# Altium project blm_ctrl.PrjPCB
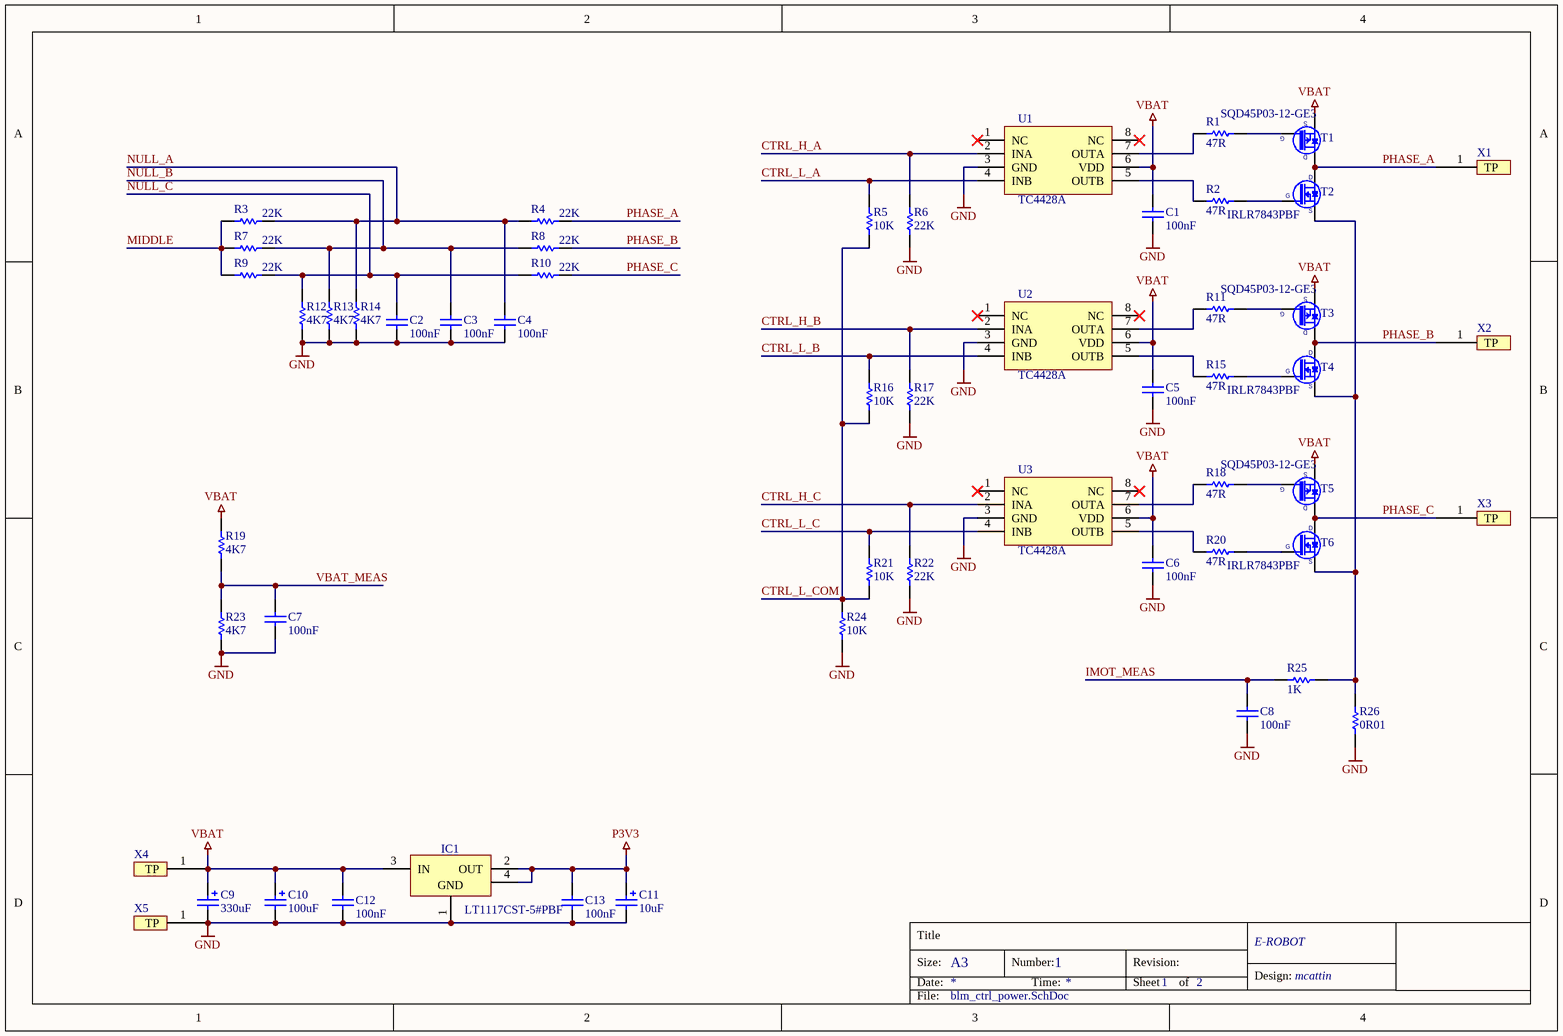
[diagram p0: blm_ctrl_power.SchDoc]
2 sheets, 101 parts. Net scope: global (net labels, ports and power ports of the same name join across sheets).
Board file: blm_ctrl.PcbDoc
Sheets:
  blm_ctrl_power.SchDoc
  blm_ctrl_cortex.SchDoc

## Sheet blm_ctrl_power.SchDoc
size A4; DrawnBy: mcattin; Organization: E-ROBOT; DocumentNumber: 1; SheetNumber: 1; SheetTotal: 2

### Parts
C1  value 100nF  [0603]  (hidden comment: Cap)
C2  value 100nF  [0603]  (hidden comment: Cap)
C3  value 100nF  [0603]  (hidden comment: Cap)
C4  value 100nF  [0603]  (hidden comment: Cap)
C5  value 100nF  [0603]  (hidden comment: Cap)
C6  value 100nF  [0603]  (hidden comment: Cap)
C7  value 100nF  [0603]  (hidden comment: Cap)
C8  value 100nF  [0603]  (hidden comment: Cap)
C9  value 330uF  [C00101]  (hidden comment: Cap Pol2)
C10  value 100uF  [C00101]  (hidden comment: Cap Pol2)
C11  value 10uF  [1206]  (hidden comment: Cap Pol2)
C12  value 100nF  [0603]  (hidden comment: Cap)
C13  value 100nF  [0603]  (hidden comment: Cap)
IC1  LT1117CST-5#PBF  [SOT230P700X180-4N]
R1  value 47R  [0603]  (hidden comment: Res1)
R2  value 47R  [0603]  (hidden comment: Res1)
R3  value 22K  [0603]  (hidden comment: Res1)
R4  value 22K  [0603]  (hidden comment: Res1)
R5  value 10K  [0603]  (hidden comment: Res1)
R6  value 22K  [0603]  (hidden comment: Res1)
R7  value 22K  [0603]  (hidden comment: Res1)
R8  value 22K  [0603]  (hidden comment: Res1)
R9  value 22K  [0603]  (hidden comment: Res1)
R10  value 22K  [0603]  (hidden comment: Res1)
R11  value 47R  [0603]  (hidden comment: Res1)
R12  value 4K7  [0603]  (hidden comment: Res1)
R13  value 4K7  [0603]  (hidden comment: Res1)
R14  value 4K7  [0603]  (hidden comment: Res1)
R15  value 47R  [0603]  (hidden comment: Res1)
R16  value 10K  [0603]  (hidden comment: Res1)
R17  value 22K  [0603]  (hidden comment: Res1)
R18  value 47R  [0603]  (hidden comment: Res1)
R19  value 4K7  [0603]  (hidden comment: Res1)
R20  value 47R  [0603]  (hidden comment: Res1)
R21  value 10K  [0603]  (hidden comment: Res1)
R22  value 22K  [0603]  (hidden comment: Res1)
R23  value 4K7  [0603]  (hidden comment: Res1)
R24  value 10K  [0603]  (hidden comment: Res1)
R25  value 1K  [0603]  (hidden comment: Res1)
R26  value 0R01  [2512]  (hidden comment: Res1)
T1  SQD45P03-12-GE3  [TO-252AA]
T2  IRLR7843PBF  [TO-252AA]
T3  SQD45P03-12-GE3  [TO-252AA]
T4  IRLR7843PBF  [TO-252AA]
T5  SQD45P03-12-GE3  [TO-252AA]
T6  IRLR7843PBF  [TO-252AA]
U1  TC4428A  [SOIC127P600-8BN]
U2  TC4428A  [SOIC127P600-8BN]
U3  TC4428A  [SOIC127P600-8BN]
X1  (no value)  [PAD_SMD_2x7MM]
X2  (no value)  [PAD_SMD_2x7MM]
X3  (no value)  [PAD_SMD_2x7MM]
X4  (no value)  [PAD_SMD_2x7MM]
X5  (no value)  [PAD_SMD_2x7MM]

### Nets
GND: C1.2 C2.2 C3.2 C4.2 C5.2 C6.2 C7.2 C8.2 C9.2 C10.2 C11.2 C12.2 C13.2 IC1.1(GND) R6.2 R12.2 R13.2 R14.2 R17.2 R22.2 R23.2 R24.2 R26.2 U1.3(GND) U2.3(GND) U3.3(GND) X5.1(TP)
P3V3: C11.1 C13.1 IC1.2(OUT) IC1.4(OUT)
VBAT: C1.1 C5.1 C6.1 C9.1 C10.1 C12.1 IC1.3(IN) R19.1 T1.3(S) T3.3(S) T5.3(S) U1.6(VDD) U2.6(VDD) U3.6(VDD) X4.1(TP)
CTRL_H_A: R6.1 U1.2(INA)
CTRL_H_B: R17.1 U2.2(INA)
CTRL_H_C: R22.1 U3.2(INA)
CTRL_L_A: R5.1 U1.4(INB)
CTRL_L_B: R16.1 U2.4(INB)
CTRL_L_C: R21.1 U3.4(INB)
CTRL_L_COM: R5.2 R16.2 R21.2 R24.1
IMOT_MEAS: C8.1 R25.2
MIDDLE: R3.1 R7.1 R9.1
NULL_A: C4.1 R3.2 R4.1 R14.1
NULL_B: C3.1 R7.2 R8.1 R13.1
NULL_C: C2.1 R9.2 R10.1 R12.1
PHASE_A: R4.2 T1.4(D) T2.4(D) X1.1(TP)
PHASE_B: R8.2 T3.4(D) T4.4(D) X2.1(TP)
PHASE_C: R10.2 T5.4(D) T6.4(D) X3.1(TP)
VBAT_MEAS: C7.1 R19.2 R23.1
NetR1_1: R1.1 T1.1(G)
NetR1_2: R1.2 U1.7(OUTA)
NetR2_1: R2.1 T2.1(G)
NetR2_2: R2.2 U1.5(OUTB)
NetR11_1: R11.1 T3.1(G)
NetR11_2: R11.2 U2.7(OUTA)
NetR15_1: R15.1 T4.1(G)
NetR15_2: R15.2 U2.5(OUTB)
NetR18_1: R18.1 T5.1(G)
NetR18_2: R18.2 U3.7(OUTA)
NetR20_1: R20.1 T6.1(G)
NetR20_2: R20.2 U3.5(OUTB)
NetR25_1: R25.1 R26.1 T2.3(S) T4.3(S) T6.3(S)

Not connected (* = marked no-connect by the designer): U1 1(NC)* 8(NC)*; U2 1(NC)* 8(NC)*; U3 1(NC)* 8(NC)*

### Notes on the sheet
- Title
- Size:
- Date:
- A3
- Number:
- Time:
- Revision:
- Sheet
- of
- Design:
- File:

### Library data of the parts
C1-C8 C12 C13 = Cap: Capacitor
  C2-C8 C12 C13: Case: 0603
C9-C11 = Cap Pol2: Polarized Capacitor (Axial)
  C9: Case: 0603
  C11: Case: 1206
IC1 = LT1117IST-5#PBF: 3-Terminal Regulator 1=GND 2=OUT 3=IN 4=OUT; Part Description: 5V, 800mA Low-Dropout Positive Regulator; Manufacturer: LINEAR TECHNOLOGY; Fournisseur: Farnell; Ref_fournisseur: 1663357; Part Number: LT1117CST-5#PBF; Device: LT1117CST-5#PBF; Case: SOT223; Price: 5.50 CHF
R1-R26 = Res1: Resistor; Case: 0603
T1 T3 T5 = BSH203: P-CHANNEL MOSFET WITH DIODE; Part Description: P-Channel 30 V (D-S) 175 °C MOSFET; Manufacturer: Vishay; Fournisseur: Farnell; Ref_fournisseur: 1869912; Part Number: SQD45P03-12-GE3; Device: SQD45P03-12-GE3; Footprint: SOT95P230X110-3N; Case: SOT252; Price: 3.60 CHF
T2 T4 T6 = BSS123: N-CHANNEL MOSFET WITH DIODE; Part Description: N MOSFET; Manufacturer: INTERNATIONAL RECTIFIER; Fournisseur: Farnell; Ref_fournisseur: 1013422; Part Number: IRLR7843PBF; Device: IRLR7843PBF; Footprint: SOT-252; Case: SOT252; Price: 2.10 CHF
U1-U3 = TC4428A: Manufacturer: MICROCHIP; Part Description: 1.5A Dual High-Speed Power MOSFET Drivers; Device: TC4428ACOA; Fournisseur: Farnell; Ref_fournisseur: 1332312; Case: SOIC8; Part Number: TC4428ACOA; Price: 1.35 CHF
X1-X5 = TEST_POINT

## Sheet blm_ctrl_cortex.SchDoc
size A4; DrawnBy: mcattin; Organization: E-ROBOT; DocumentNumber: 2; SheetNumber: 2; SheetTotal: 2
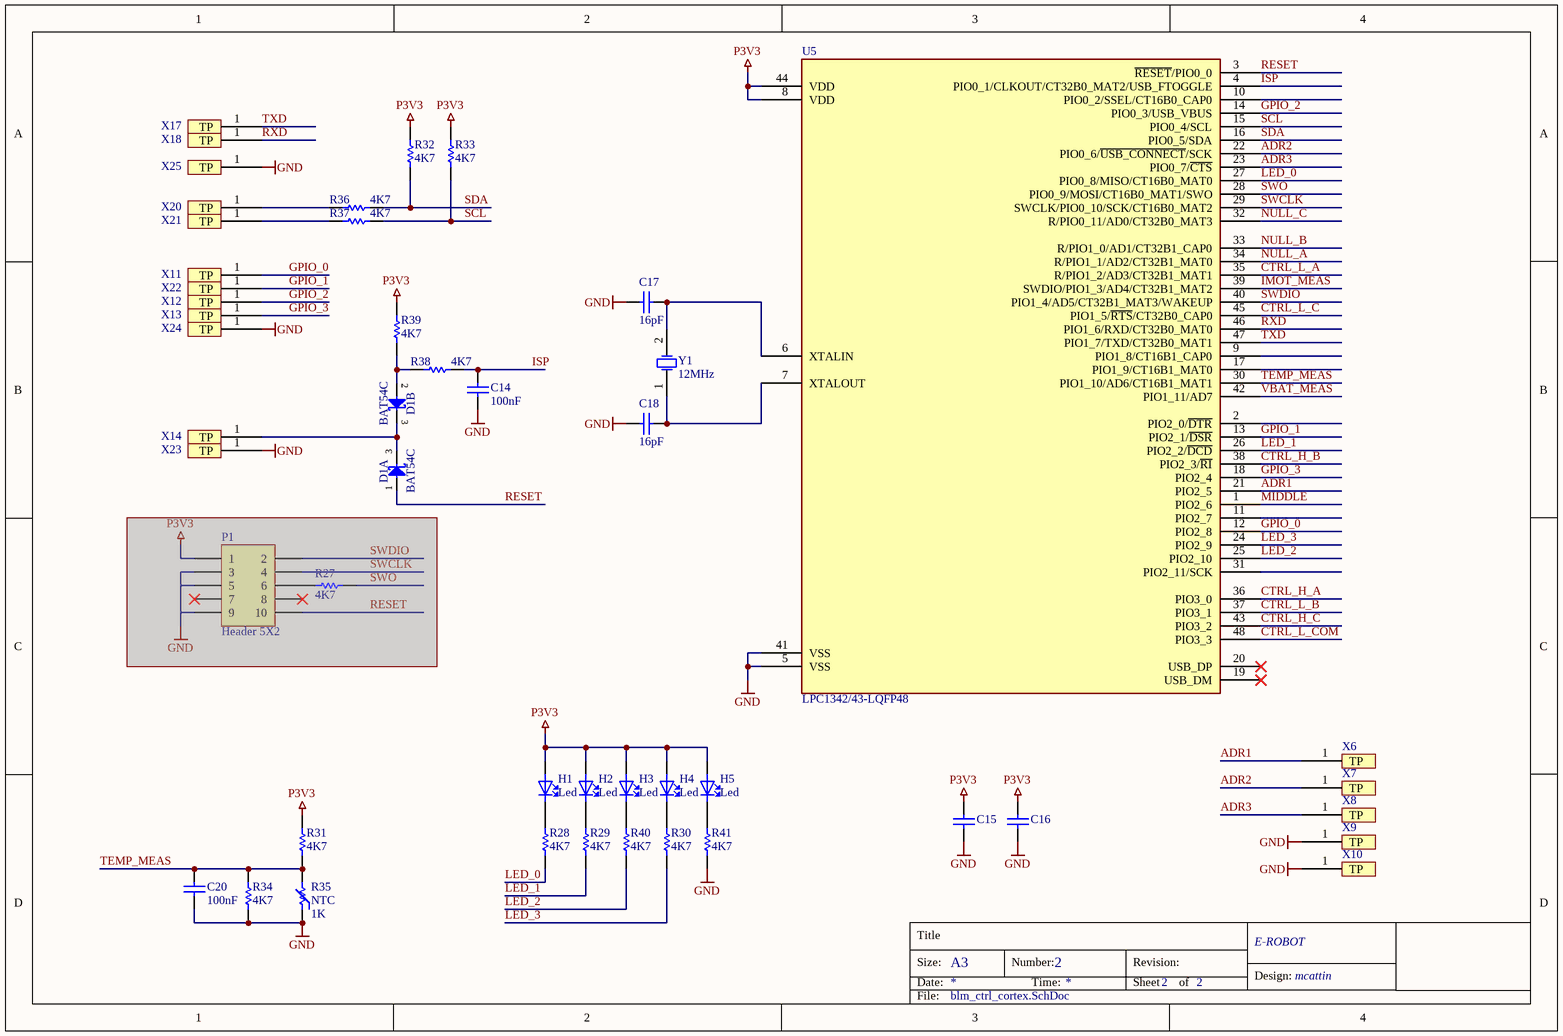
[diagram p1: blm_ctrl_cortex.SchDoc]

### Parts
C14  value 100nF  [0603]  (hidden comment: Cap)
C15  Cap  [0603]  (value not drawn)
C16  Cap  [0603]  (value not drawn)
C17  value 16pF  [0603]  (hidden comment: Cap)
C18  value 16pF  [0603]  (hidden comment: Cap)
C20  value 100nF  [0603]  (hidden comment: Cap)
D1  BAT54C  [SOT95P240X130-3N]  (parts A,B of 2)
H1  Led  [0603_LED]
H2  Led  [0603_LED]
H3  Led  [0603_LED]
H4  Led  [0603_LED]
H5  Led  [0603_LED]
P1  Header 5X2  [HDR2X5]  (masked out: inside a compile mask, not in the netlist)
R27  value 4K7  [0603]  (hidden comment: Res1)  (masked out: inside a compile mask, not in the netlist)
R28  value 4K7  [0603]  (hidden comment: Res1)
R29  value 4K7  [0603]  (hidden comment: Res1)
R30  value 4K7  [0603]  (hidden comment: Res1)
R31  value 4K7  [0603]  (hidden comment: Res1)
R32  value 4K7  [0603]  (hidden comment: Res1)
R33  value 4K7  [0603]  (hidden comment: Res1)
R34  value 4K7  [0603]  (hidden comment: Res1)
R35  NTC  value 1K  [0603]
R36  value 4K7  [0603]  (hidden comment: Res1)
R37  value 4K7  [0603]  (hidden comment: Res1)
R38  value 4K7  [0603]  (hidden comment: Res1)
R39  value 4K7  [0603]  (hidden comment: Res1)
R40  value 4K7  [0603]  (hidden comment: Res1)
R41  value 4K7  [0603]  (hidden comment: Res1)
U5  LPC1342/43-LQFP48  [TSQFP50P900X900-48N]
X6  (no value)  [PAD_SMD_0.5x1MM]
X7  (no value)  [PAD_SMD_0.5x1MM]
X8  (no value)  [PAD_SMD_0.5x1MM]
X9  (no value)  [PAD_SMD_0.5x1MM]
X10  (no value)  [PAD_SMD_0.5x1MM]
X11  (no value)  [PAD_SMD_1x2MM]
X12  (no value)  [PAD_SMD_1x2MM]
X13  (no value)  [PAD_SMD_1x2MM]
X14  (no value)  [PAD_SMD_1x2MM]
X17  (no value)  [PAD_SMD_1x2MM]
X18  (no value)  [PAD_SMD_1x2MM]
X20  (no value)  [PAD_SMD_1x2MM]
X21  (no value)  [PAD_SMD_1x2MM]
X22  (no value)  [PAD_SMD_1x2MM]
X23  (no value)  [PAD_SMD_1x2MM]
X24  (no value)  [PAD_SMD_1x2MM]
X25  (no value)  [PAD_SMD_1x2MM]
Y1  12MHz  [QUARTZ_SMD_CX5032]

### Nets
GND: C14.2 C15.2 C16.2 C17.1 C18.1 C20.2 R34.2 R35.2 R41.2 U5.5(VSS) U5.41(VSS) X9.1(TP) X10.1(TP) X23.1(TP) X24.1(TP) X25.1(TP)
P3V3: C15.1 C16.1 H1.1(ANODE) H2.1(ANODE) H3.1(ANODE) H4.1(ANODE) H5.1(ANODE) R31.1 R32.1 R33.1 R39.2 U5.8(VDD) U5.44(VDD)
ADR1: U5.21(PIO2_5) X6.1(TP)
ADR2: U5.22(PIO0_6/~{USB_CONNECT}/SCK) X7.1(TP)
ADR3: U5.23(PIO0_7/~{CTS}) X8.1(TP)
CTRL_H_A: U5.36(PIO3_0)
CTRL_H_B: U5.38(PIO2_3/~{RI})
CTRL_H_C: U5.43(PIO3_2)
CTRL_L_A: U5.35(R/PIO1_2/AD3/CT32B1_MAT1)
CTRL_L_B: U5.37(PIO3_1)
CTRL_L_C: U5.45(PIO1_5/~{RTS}/CT32B0_CAP0)
CTRL_L_COM: U5.48(PIO3_3)
GPIO_0: U5.12(PIO2_8) X11.1(TP)
GPIO_1: U5.13(PIO2_1/~{DSR}) X22.1(TP)
GPIO_2: U5.14(PIO0_3/USB_VBUS) X12.1(TP)
GPIO_3: U5.18(PIO2_4) X13.1(TP)
IMOT_MEAS: U5.39(SWDIO/PIO1_3/AD4/CT32B1_MAT2)
ISP: C14.1 R38.1 U5.4(PIO0_1/CLKOUT/CT32B0_MAT2/USB_FTOGGLE)
LED_0: R28.2 U5.27(PIO0_8/MISO/CT16B0_MAT0)
LED_1: R29.2 U5.26(PIO2_2/~{DCD})
LED_2: R40.2 U5.25(PIO2_10)
LED_3: R30.2 U5.24(PIO2_9)
MIDDLE: U5.1(PIO2_6)
NULL_A: U5.34(R/PIO1_1/AD2/CT32B1_MAT0)
NULL_B: U5.33(R/PIO1_0/AD1/CT32B1_CAP0)
NULL_C: U5.32(R/PIO0_11/AD0/CT32B0_MAT3)
RESET: D1.1(A) U5.3(~{RESET}/PIO0_0)
RXD: U5.46(PIO1_6/RXD/CT32B0_MAT0) X18.1(TP)
SCL: R33.2 R37.1 U5.15(PIO0_4/SCL)
SDA: R32.2 R36.1 U5.16(PIO0_5/SDA)
SWCLK: U5.29(SWCLK/PIO0_10/SCK/CT16B0_MAT2)
SWDIO: U5.40(PIO1_4/AD5/CT32B1_MAT3/WAKEUP)
SWO: U5.28(PIO0_9/MOSI/CT16B0_MAT1/SWO)
TEMP_MEAS: C20.1 R31.2 R34.1 R35.1 U5.30(PIO1_10/AD6/CT16B1_MAT1)
TXD: U5.47(PIO1_7/TXD/CT32B0_MAT1) X17.1(TP)
VBAT_MEAS: U5.42(PIO1_11/AD7)
NetC17_2: C17.2 U5.6(XTALIN) Y1.2(OSC2)
NetC18_2: C18.2 U5.7(XTALOUT) Y1.1(OSC1)
NetD1_2: D1.2(A) R38.2 R39.1
NetD1_3: D1.3(COMC) X14.1(TP)
NetH1_2: H1.2(CATHODE) R28.1
NetH2_2: H2.2(CATHODE) R29.1
NetH3_2: H3.2(CATHODE) R40.1
NetH4_2: H4.2(CATHODE) R30.1
NetH5_2: H5.2(CATHODE) R41.1
NetR36_2: R36.2 X20.1(TP)
NetR37_2: R37.2 X21.1(TP)

Not connected (* = marked no-connect by the designer): U5 2(PIO2_0/~{DTR}) 9(PIO1_8/CT16B1_CAP0) 10(PIO0_2/SSEL/CT16B0_CAP0) 11(PIO2_7) 17(PIO1_9/CT16B1_MAT0) 19(USB_DM)* 20(USB_DP)* 31(PIO2_11/SCK)

### Notes on the sheet
- Title
- Size:
- Date:
- A3
- Number:
- Time:
- Revision:
- Sheet
- of
- Design:
- File:

### Library data of the parts
C14-C18 C20 = Cap: Capacitor; Case: 0603
D1 = BAT54C: Dual Common Cathode Schottky Diodes; Part Description: Dual Common Cathode Small Signal Schottky Diode; Manufacturer: FAIRCHILD SEMICONDUCTOR; Fournisseur: Farnell; Ref_fournisseur: 1081192; Part Number: BAT54C; Component Kind: Standard; Device: BAT54C; Case: SOT23-3; Author: CERN DEM JLC; Price: 0.758 CHF
H1-H5 = Led: Led low current; Fournisseur: *; Ref_fournisseur: *; Case: 0603
P1 = Header 5X2: Header, 5-Pin, Dual row; LatestRevisionDate: 17-Jul-2002; LatestRevisionNote: Re-released for DXP Platform.; Publisher: Altium Limited
R27-R34 R36-R41 = Res1: Resistor
  R27: Published: 8-Jun-2000; LatestRevisionDate: 17-Jul-2002; LatestRevisionNote: Re-released for DXP Platform.; PackageReference: AXIAL-0.3; Publisher: Altium Limited
  R28-R34 R36-R41: Case: 0603
R35 = NTC: Temperature dependent resistor; Case: 0603
U5 = LPC1342/43-LQFP48: Manufacturer: NXP; Part Description: 32-bit ARM Cortex-M3 microcontroller; up to 32 kB flash and 8 kB SRAM; USB device; Part Number: LPC1343FBD48; Device: LPC1343; Fournisseur: Farnell; Ref_fournisseur: 1762580; Case: LQFP48; Price: 9.60 CHF
X6-X14 X17 X18 X20-X25 = TEST_POINT
Y1 = XTAL: Crystal Oscillator; Manufacturer: AVX; Part Number: CX5032GB12000H0PESZZ; Device: Quartz; Fournisseur: Farnell; Ref_fournisseur: 1368769; Case: 5mm x 3.2mm; Value: 12 MHz; Price: 2.15 CHF

## Nets that join several sheets
GND: blm_ctrl_power (27 pins), blm_ctrl_cortex (16 pins)
P3V3: blm_ctrl_power (C11.1 C13.1 IC1.2 IC1.4), blm_ctrl_cortex (13 pins)
CTRL_H_A: blm_ctrl_power (R6.1 U1.2), blm_ctrl_cortex (U5.36)
CTRL_H_B: blm_ctrl_power (R17.1 U2.2), blm_ctrl_cortex (U5.38)
CTRL_H_C: blm_ctrl_power (R22.1 U3.2), blm_ctrl_cortex (U5.43)
CTRL_L_A: blm_ctrl_power (R5.1 U1.4), blm_ctrl_cortex (U5.35)
CTRL_L_B: blm_ctrl_power (R16.1 U2.4), blm_ctrl_cortex (U5.37)
CTRL_L_C: blm_ctrl_power (R21.1 U3.4), blm_ctrl_cortex (U5.45)
CTRL_L_COM: blm_ctrl_power (R5.2 R16.2 R21.2 R24.1), blm_ctrl_cortex (U5.48)
IMOT_MEAS: blm_ctrl_power (C8.1 R25.2), blm_ctrl_cortex (U5.39)
MIDDLE: blm_ctrl_power (R3.1 R7.1 R9.1), blm_ctrl_cortex (U5.1)
NULL_A: blm_ctrl_power (C4.1 R3.2 R4.1 R14.1), blm_ctrl_cortex (U5.34)
NULL_B: blm_ctrl_power (C3.1 R7.2 R8.1 R13.1), blm_ctrl_cortex (U5.33)
NULL_C: blm_ctrl_power (C2.1 R9.2 R10.1 R12.1), blm_ctrl_cortex (U5.32)
VBAT_MEAS: blm_ctrl_power (C7.1 R19.2 R23.1), blm_ctrl_cortex (U5.42)